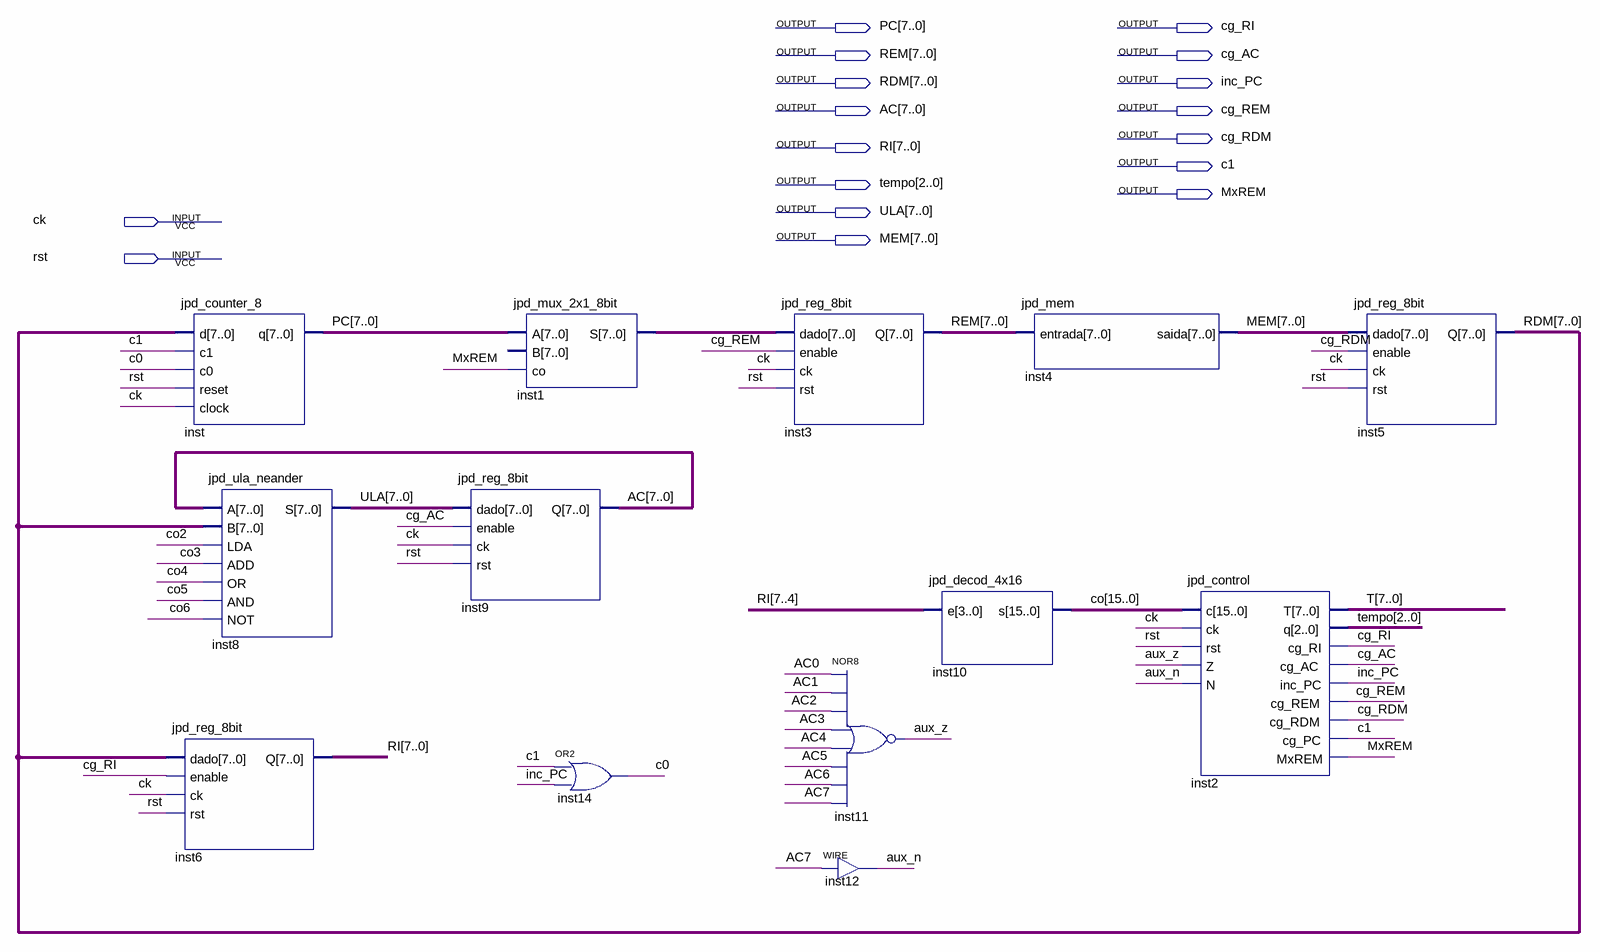
[diagram p0: schematic sheet]
// Quartus schematic jpd_neander.bdf as structural Verilog: 13 symbols, 17 pins
module jpd_neander (
  input  ck,
  input  rst,
  output [7:0] PC,
  output cg_RI,
  output [7:0] REM,
  output cg_AC,
  output [7:0] RDM,
  output inc_PC,
  output [7:0] AC,
  output cg_REM,
  output cg_RDM,
  output [7:0] RI,
  output c1,
  output [2:0] tempo,
  output MxREM,
  output [7:0] ULA,
  output [7:0] MEM
);

  wire aux_n, aux_z, c0;
  wire [7:0] inst1_s, T;
  wire [15:0] co;

  jpd_counter_8 inst (.d(RDM), .c1(c1), .c0(c0), .reset(rst), .clock(ck), .q(PC));
  jpd_ula_neander inst8 (.A(AC), .B(RDM), .LDA(co[2]), .ADD(co[3]), .OR(co[4]), .AND(co[5]), .NOT(co[6]), .S(ULA));
  jpd_reg_8bit inst6 (.dado(RDM), .enable(cg_RI), .ck(ck), .rst(rst), .Q(RI));
  jpd_mux_2x1_8bit inst1 (.A(PC), .co(MxREM), .S(inst1_s));  // open: B
  jpd_reg_8bit inst9 (.dado(ULA), .enable(cg_AC), .ck(ck), .rst(rst), .Q(AC));
  or inst14 (c0, c1, inc_PC);
  jpd_reg_8bit inst3 (.dado(inst1_s), .enable(cg_REM), .ck(ck), .rst(rst), .Q(REM));
  nor inst11 (aux_z, AC[0], AC[1], AC[2], AC[3], AC[4], AC[5], AC[6], AC[7]);
  assign aux_n = AC[7];  // WIRE inst12
  jpd_decod_4x16 inst10 (.e(RI[7:4]), .s(co));
  jpd_mem inst4 (.entrada(REM), .saida(MEM));
  jpd_control inst2 (
    .c(co), .ck(ck), .rst(rst), .Z(aux_z), .N(aux_n), .T(T), .q(tempo), .cg_RI(cg_RI), .cg_AC(cg_AC),
    .inc_PC(inc_PC), .cg_REM(cg_REM), .cg_RDM(cg_RDM), .cg_PC(c1), .MxREM(MxREM));
  jpd_reg_8bit inst5 (.dado(MEM), .enable(cg_RDM), .ck(ck), .rst(rst), .Q(RDM));
endmodule
